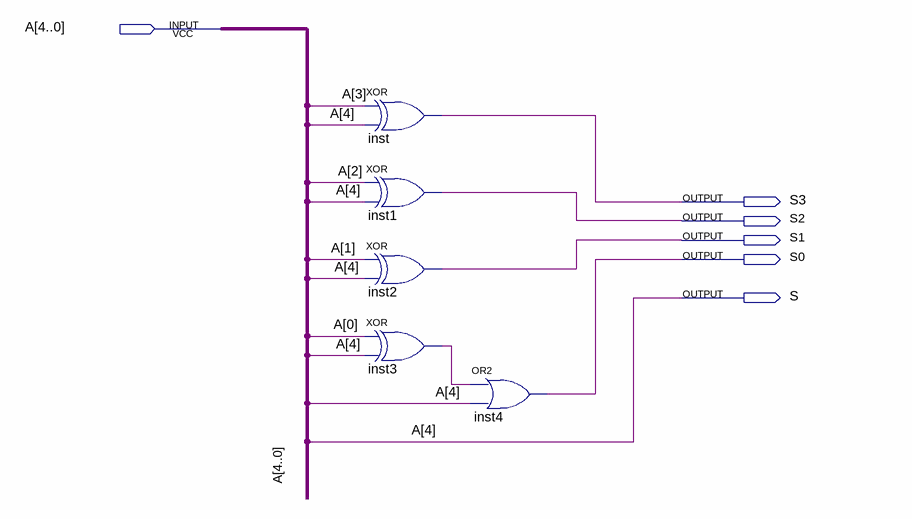
[diagram p0: schematic sheet]
// Quartus schematic complemento2 - Copy.bdf as structural Verilog: 5 symbols, 6 pins
module \complemento2_-_Copy  (
  input  [4:0] A,
  output S3,
  output S2,
  output S1,
  output S0,
  output S
);

  wire inst3_out;

  xor inst (S3, A[3], A[4]);
  xor inst1 (S2, A[2], A[4]);
  xor inst2 (S1, A[1], A[4]);
  xor inst3 (inst3_out, A[0], A[4]);
  or inst4 (S0, inst3_out, A[4]);

  assign S = A[4];
endmodule
